# EAGLE design YAKS2-TITUO.R03.1al.v2smd (EAGLE 9.6.2)

## Sheet 1 of 2
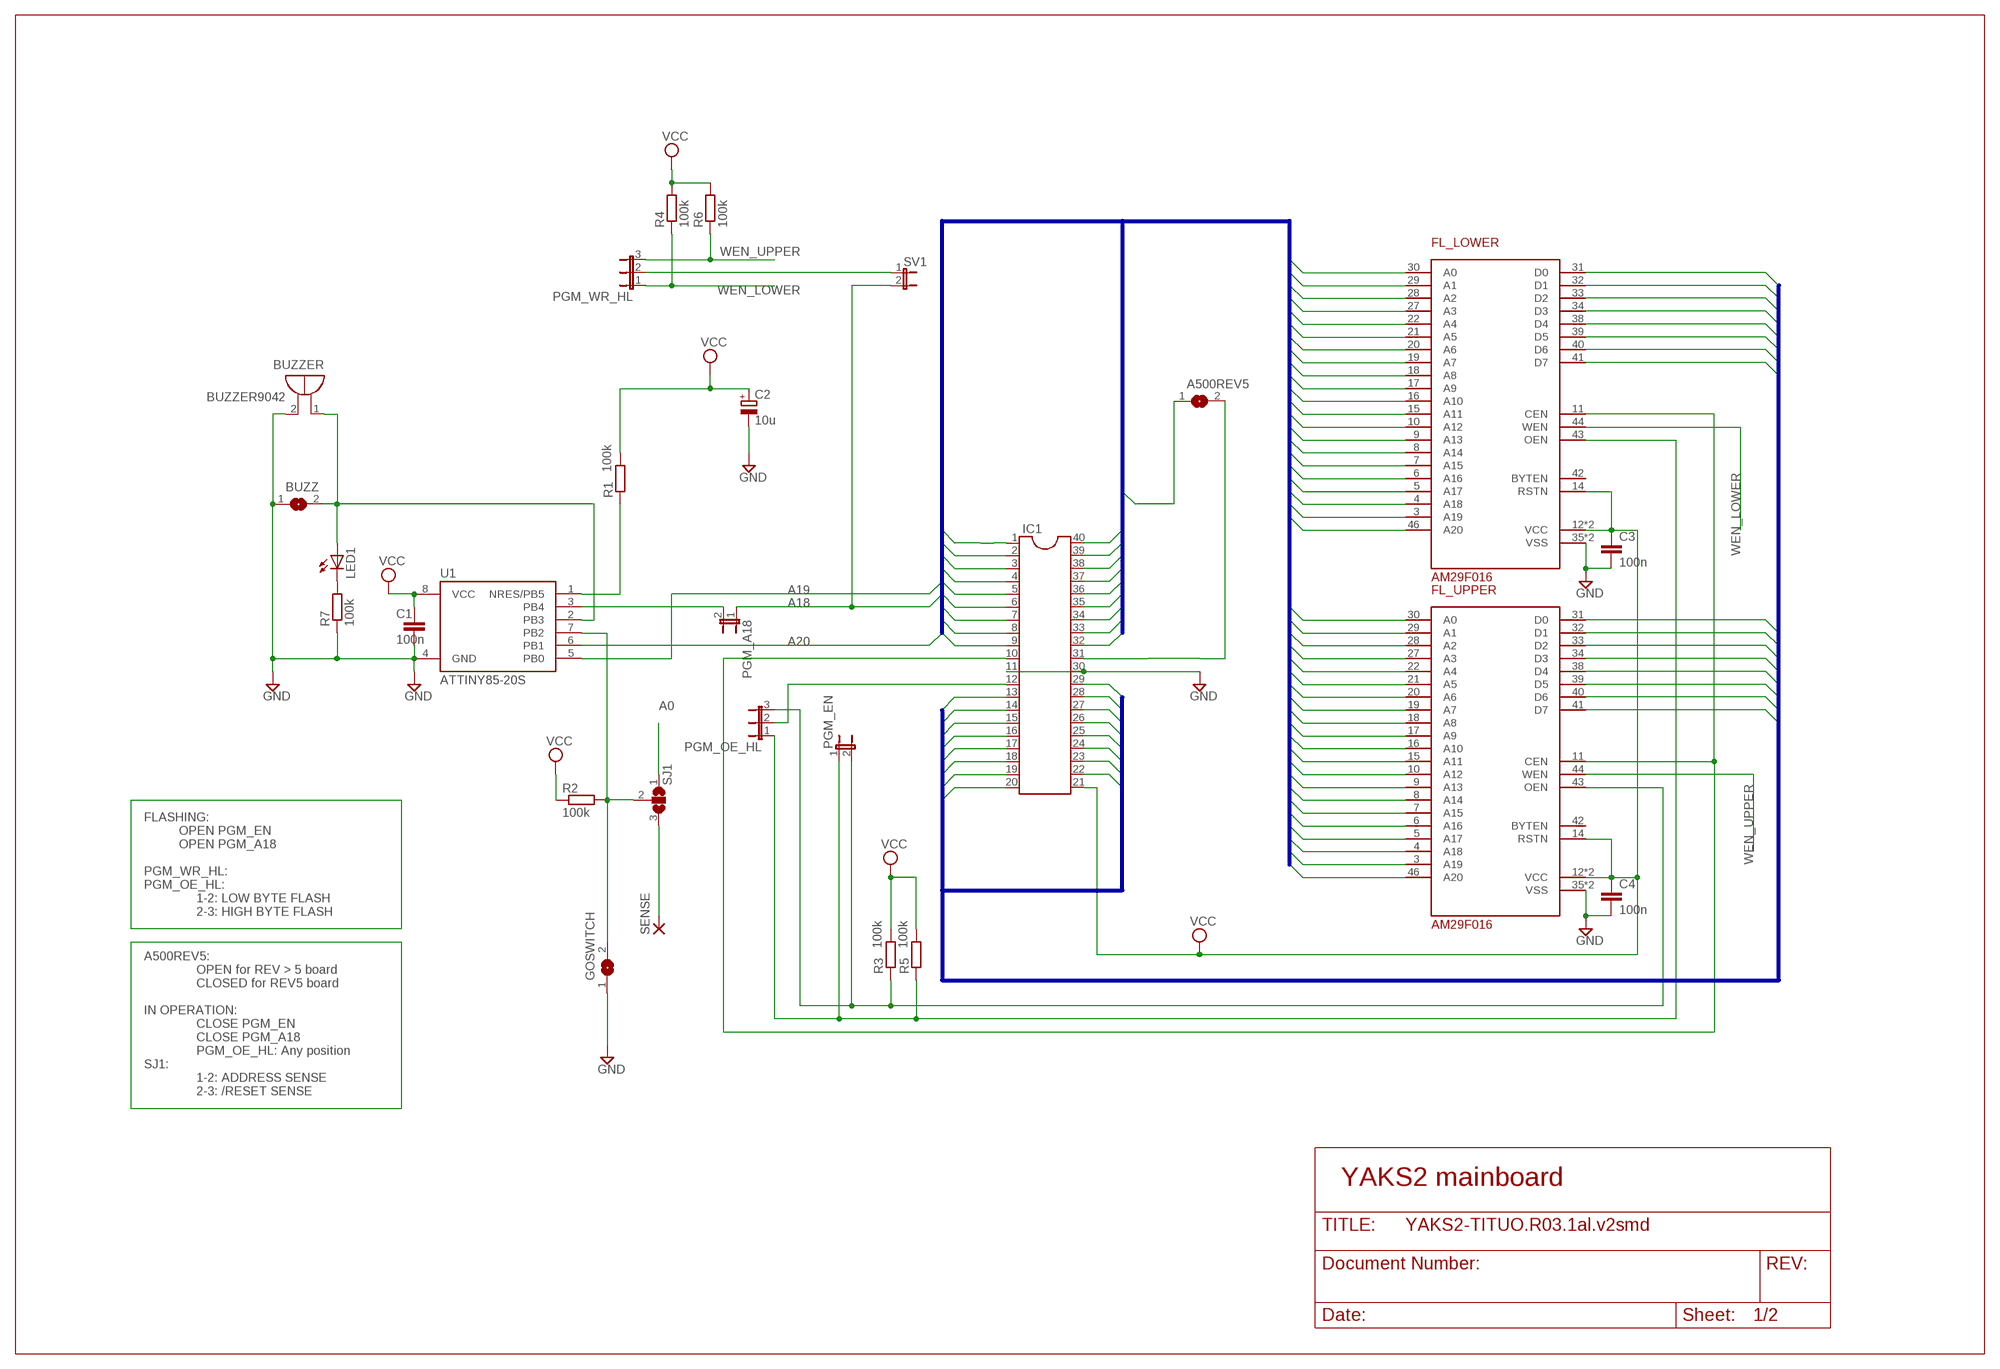
[diagram p0: schematic, sheet 1]

### Parts
A500REV5  SJ  [SJ]
BUZZ  SJ  [SJ]
BUZZER  BUZZER9042  [CAPPRD400W65D900H420B]
C1  100n  C-EUC0805  [C0805]
C2  10u  CPOL-EUB/3528-21R  [B/3528-21R]
C3  100n  C-EUC0805  [C0805]
C4  100n  C-EUC0805  [C0805]
FL_LOWER  AM29F016  [TSOP48]
FL_UPPER  AM29F016  [TSOP48]
GOSWITCH  SJ  [SJ]
IC1  DIL40  [DIL40]
LED1  LEDSML0805  [SML0805]
PGM_A18  JP1E  [JP1]
PGM_EN  JP1E  [JP1]
PGM_OE_HL  JP2E  [JP2]
PGM_WR_HL  JP2E  [JP2]
R1  100k  R-EU_M0805  [M0805]
R2  100k  R-EU_M0805  [M0805]
R3  100k  R-EU_M0805  [M0805]
R4  100k  R-EU_M0805  [M0805]
R5  100k  R-EU_M0805  [M0805]
R6  100k  R-EU_M0805  [M0805]
R7  100k  R-EU_M0805  [M0805]
SENSE  SMD2  [SMD1,27-2,54]
SJ1  SJ2W  [SJ_2]
SV1  JP1E  [JP1]
U1  ATTINY85-20S  [SOIC8_EIAJ_208MIL]

### Nets
A0: FL_LOWER.30(A0) FL_UPPER.30(A0) IC1.9 SJ1.1
A1: FL_LOWER.29(A1) FL_UPPER.29(A1) IC1.8
A2: FL_LOWER.28(A2) FL_UPPER.28(A2) IC1.7
A3: FL_LOWER.27(A3) FL_UPPER.27(A3) IC1.6
A4: FL_LOWER.22(A4) FL_UPPER.22(A4) IC1.5
A5: FL_LOWER.21(A5) FL_UPPER.21(A5) IC1.4
A6: FL_LOWER.20(A6) FL_UPPER.20(A6) IC1.3
A7: FL_LOWER.19(A7) FL_UPPER.19(A7) IC1.2
A8: FL_LOWER.18(A8) FL_UPPER.18(A8) IC1.40
A9: FL_LOWER.17(A9) FL_UPPER.17(A9) IC1.39
A10: FL_LOWER.16(A10) FL_UPPER.16(A10) IC1.38
A11: FL_LOWER.15(A11) FL_UPPER.15(A11) IC1.37
A12: FL_LOWER.10(A12) FL_UPPER.10(A12) IC1.36
A13: FL_LOWER.9(A13) FL_UPPER.9(A13) IC1.35
A14: FL_LOWER.8(A14) FL_UPPER.8(A14) IC1.34
A15: FL_LOWER.7(A15) FL_UPPER.7(A15) IC1.33
A16: FL_LOWER.6(A16) FL_UPPER.6(A16) IC1.32
A17: A500REV5.1 FL_LOWER.5(A17) FL_UPPER.5(A17) IC1.1
A18: FL_LOWER.4(A18) FL_UPPER.4(A18) PGM_A18.1 SV1.2
A19: FL_LOWER.3(A19) FL_UPPER.3(A19) U1.5(PB0)
A20: FL_LOWER.46(A20) FL_UPPER.46(A20) U1.6(PB1)
BUZZ: BUZZ.2 BUZZER.1(+) LED1.A U1.2(PB3)
D0: FL_LOWER.31(D0) IC1.13
D1: FL_LOWER.32(D1) IC1.15
D2: FL_LOWER.33(D2) IC1.17
D3: FL_LOWER.34(D3) IC1.19
D4: FL_LOWER.38(D4) IC1.22
D5: FL_LOWER.39(D5) IC1.24
D6: FL_LOWER.40(D6) IC1.26
D7: FL_LOWER.41(D7) IC1.28
D8: FL_UPPER.31(D0) IC1.14
D9: FL_UPPER.32(D1) IC1.16
D10: FL_UPPER.33(D2) IC1.18
D11: FL_UPPER.34(D3) IC1.20
D12: FL_UPPER.38(D4) IC1.23
D13: FL_UPPER.39(D5) IC1.25
D14: FL_UPPER.40(D6) IC1.27
D15: FL_UPPER.41(D7) IC1.29
GND: BUZZ.1 BUZZER.2(-) C1.2 C2.- C3.2 C4.2 FL_LOWER.35(VSS) FL_LOWER.36(VSS) FL_UPPER.35(VSS) FL_UPPER.36(VSS) GOSWITCH.1 IC1.11 IC1.30 R7.1 U1.4(GND)
N$1: LED1.C R7.2
N$2: PGM_WR_HL.2 SV1.1
N$3: A500REV5.2 IC1.31
N$6: GOSWITCH.2 R2.2 SJ1.2 U1.7(PB2)
N$7: IC1.12 PGM_OE_HL.2
N$8: SENSE.1(P) SJ1.3
N$9: R1.1 U1.1(NRES/PB5)
N$15: PGM_A18.2 U1.3(PB4)
OEN_LOWER: FL_LOWER.43(OEN) PGM_EN.1 PGM_OE_HL.1 R5.1
OEN_UPPER: FL_UPPER.43(OEN) PGM_EN.2 PGM_OE_HL.3 R3.1
ROM_ENABLE: FL_LOWER.11(CEN) FL_UPPER.11(CEN) IC1.10
VCC: C1.1 C2.+ C3.1 C4.1 FL_LOWER.12(VCC) FL_LOWER.14(RSTN) FL_LOWER.37(VCC) FL_UPPER.12(VCC) FL_UPPER.14(RSTN) FL_UPPER.37(VCC) IC1.21 R1.2 R2.1 R3.2 R4.2 R5.2 R6.2 U1.8(VCC)
WEN_LOWER: FL_LOWER.44(WEN) PGM_WR_HL.1 R4.1
WEN_UPPER: FL_UPPER.44(WEN) PGM_WR_HL.3 R6.1
Unconnected: FL_LOWER.42(BYTEN) FL_UPPER.42(BYTEN)

### Buses
A[0..20]
D[0..15]

### Notes on the sheet
- FLASHING:
            OPEN PGM_EN 
            OPEN PGM_A18
           
  PGM_WR_HL:
  PGM_OE_HL: 
                 1-2: LOW BYTE FLASH
                 2-3: HIGH BYTE FLASH
- A500REV5: 
                 OPEN for REV > 5 board
                 CLOSED for REV5 board
  
  IN OPERATION: 
                 CLOSE PGM_EN
                 CLOSE PGM_A18 
                 PGM_OE_HL: Any position
  SJ1:
                 1-2: ADDRESS SENSE
                 2-3: /RESET SENSE
- YAKS2 mainboard

## Sheet 2 of 2
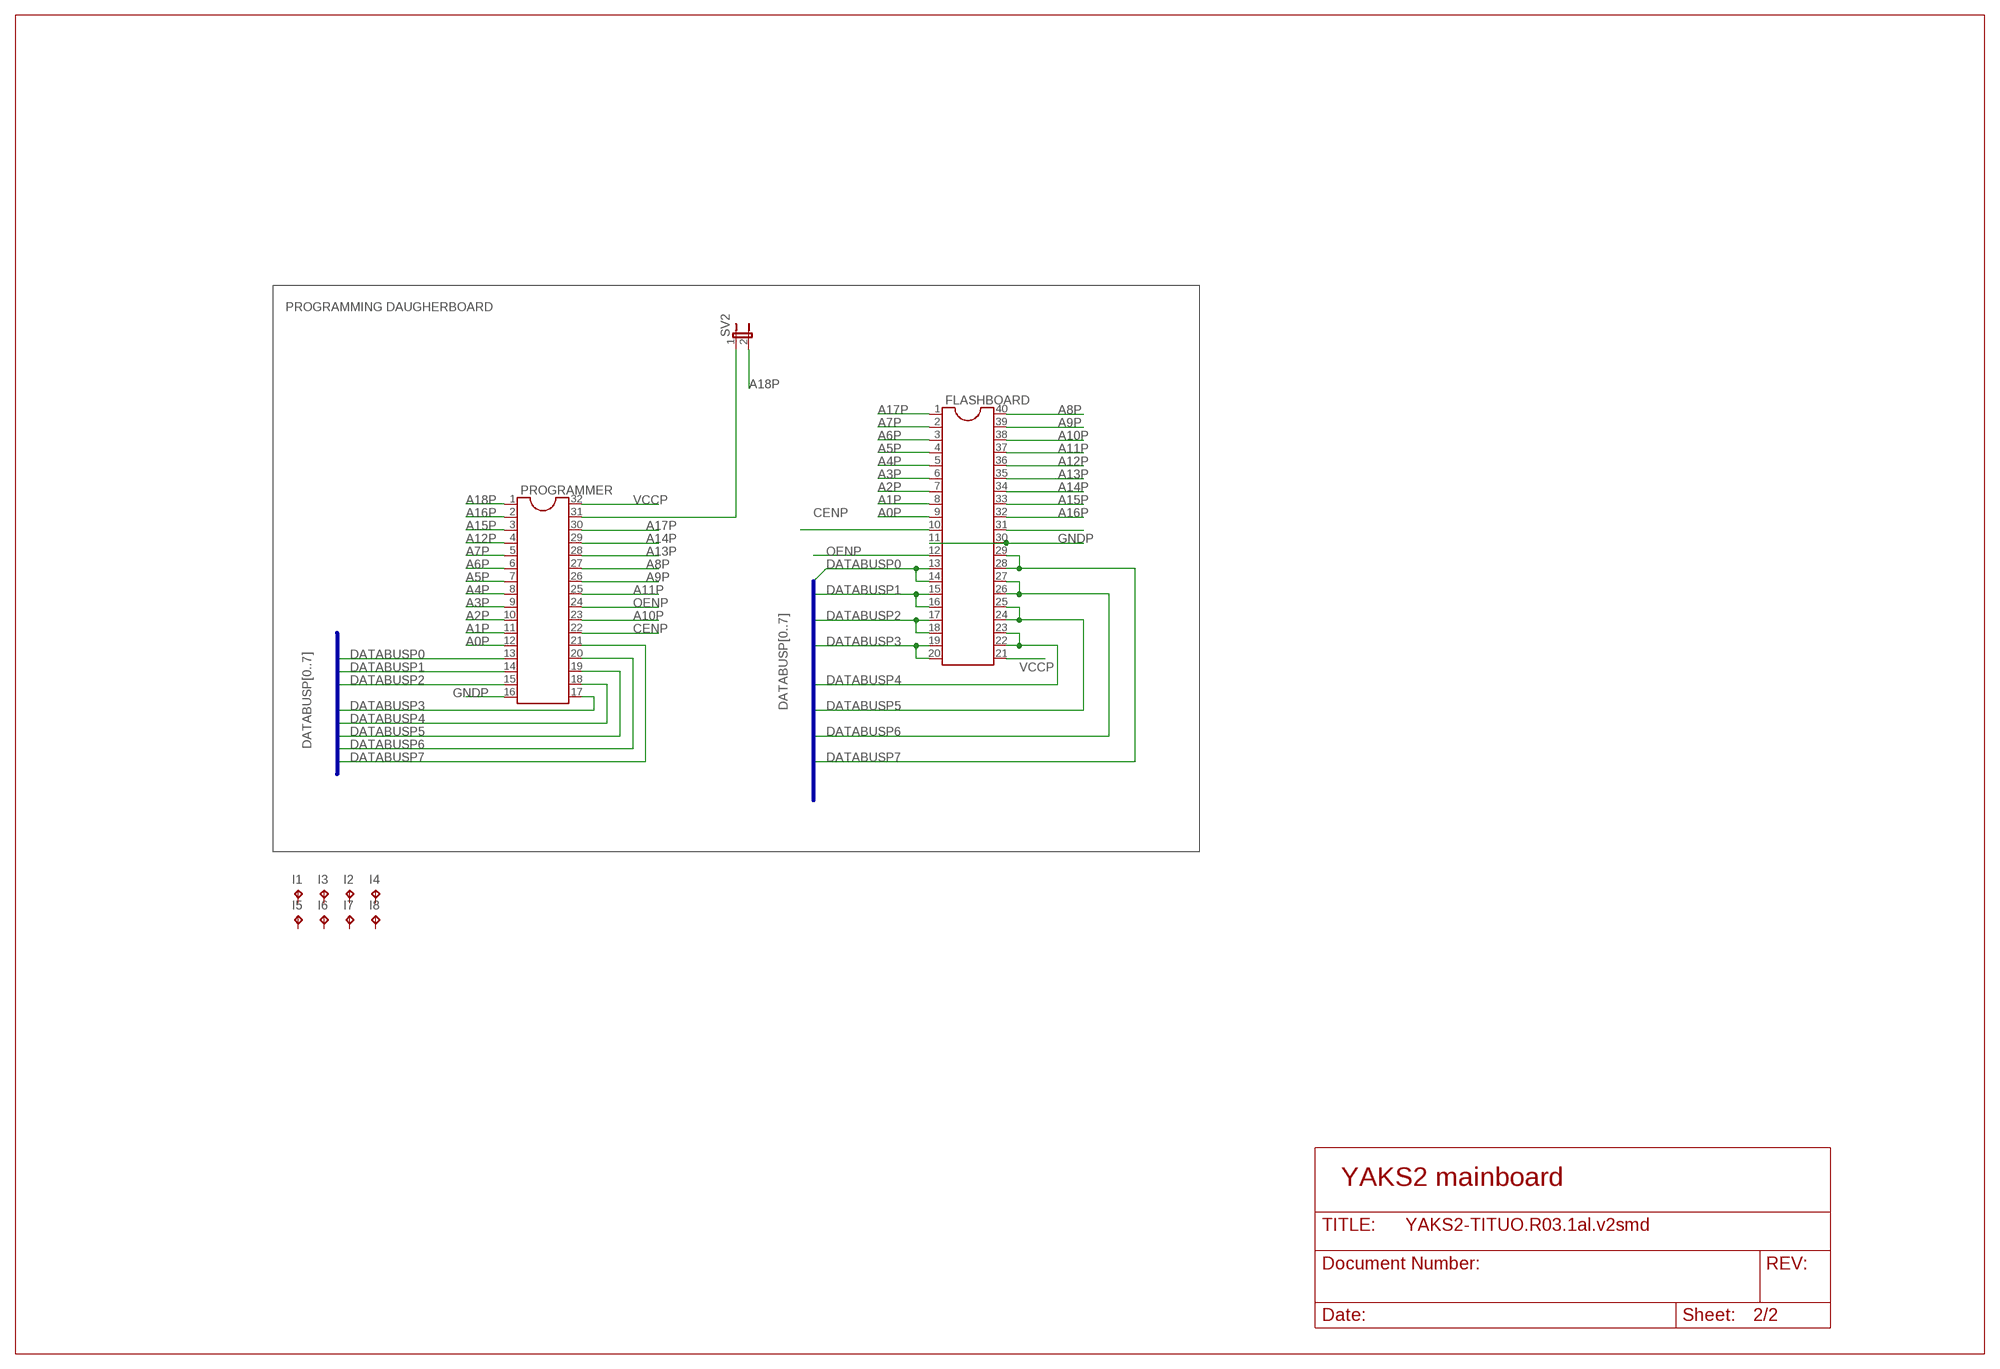
[diagram p1: schematic, sheet 2]

### Parts
FLASHBOARD  DIL40  [DIL40]
I1  TPTP20SQ  [TP20SQ]
I2  TPTP20SQ  [TP20SQ]
I3  TPTP20SQ  [TP20SQ]
I4  TPTP20SQ  [TP20SQ]
I5  TPTP20SQ  [TP20SQ]
I6  TPTP20SQ  [TP20SQ]
I7  TPTP20SQ  [TP20SQ]
I8  TPTP20SQ  [TP20SQ]
PROGRAMMER  DIL32  [DIL32]
SV2  JP1E  [JP1]

### Nets
A0P: FLASHBOARD.9 PROGRAMMER.12
A1P: FLASHBOARD.8 PROGRAMMER.11
A2P: FLASHBOARD.7 PROGRAMMER.10
A3P: FLASHBOARD.6 PROGRAMMER.9
A4P: FLASHBOARD.5 PROGRAMMER.8
A5P: FLASHBOARD.4 PROGRAMMER.7
A6P: FLASHBOARD.3 PROGRAMMER.6
A7P: FLASHBOARD.2 PROGRAMMER.5
A8P: FLASHBOARD.40 PROGRAMMER.27
A9P: FLASHBOARD.39 PROGRAMMER.26
A10P: FLASHBOARD.38 PROGRAMMER.23
A11P: FLASHBOARD.37 PROGRAMMER.25
A12P: FLASHBOARD.36 PROGRAMMER.4
A13P: FLASHBOARD.35 PROGRAMMER.28
A14P: FLASHBOARD.34 PROGRAMMER.29
A15P: FLASHBOARD.33 PROGRAMMER.3
A16P: FLASHBOARD.32 PROGRAMMER.2
A17P: FLASHBOARD.1 PROGRAMMER.30
A18P: PROGRAMMER.1 SV2.2
CENP: FLASHBOARD.10 PROGRAMMER.22
DATABUSP0: FLASHBOARD.13 FLASHBOARD.14 PROGRAMMER.13
DATABUSP1: FLASHBOARD.15 FLASHBOARD.16 PROGRAMMER.14
DATABUSP2: FLASHBOARD.17 FLASHBOARD.18 PROGRAMMER.15
DATABUSP3: FLASHBOARD.19 FLASHBOARD.20 PROGRAMMER.17
DATABUSP4: FLASHBOARD.22 FLASHBOARD.23 PROGRAMMER.18
DATABUSP5: FLASHBOARD.24 FLASHBOARD.25 PROGRAMMER.19
DATABUSP6: FLASHBOARD.26 FLASHBOARD.27 PROGRAMMER.20
DATABUSP7: FLASHBOARD.28 FLASHBOARD.29 PROGRAMMER.21
GNDP: FLASHBOARD.11 FLASHBOARD.30 PROGRAMMER.16
N$10: PROGRAMMER.31 SV2.1
N$14: FLASHBOARD.31
OENP: FLASHBOARD.12 PROGRAMMER.24
VCCP: FLASHBOARD.21 PROGRAMMER.32
Unconnected: I1.TP I2.TP I3.TP I4.TP I5.TP I6.TP I7.TP I8.TP

### Buses
DATABUSP[0..7]

### Notes on the sheet
- PROGRAMMING DAUGHERBOARD
- YAKS2 mainboard

## Library data of the parts
A500REV5 BUZZ GOSWITCH = jumper:SJ: SMD solder JUMPER
BUZZER = 9042.Buzzer:BUZZER9042
C1 C3 C4 = resistor:C-EU: CAPACITOR, European symbol
C2 = rcl:CPOL-EU: POLARIZED CAPACITOR, European symbol; SPICEPREFIX: C
FL_LOWER FL_UPPER = flashmemory:AM29F016
FLASHBOARD IC1 = ic-package:DIL40: Dual In Line
I1-I8 = testpad:TP: Test pad
LED1 = led:LED: LED OSRAM: - CHIPLED LG R971, LG N971, LY N971, LG Q971, LY Q971, LO R971, LY R971 LH N974, LH R974 LS Q976, LO Q976, LY Q976 LO Q996 - Hyper CHIPLED LW Q18S LB Q993, LB Q99A, LB R99A - SideLED LS A670, LO A670, LY A670, LG A670, LP A670 LB A673, LV A673, LT A673, LW A673 LH A674 LY A675 LS A676, LA A676, LO A676, LY A676, LW A676 LS A679, LY A679, LG A679 - Hyper Micro SIDELED® LS Y876, LA Y876, LO Y876, LY Y876 LT Y87S - SmartLED LW L88C, LW L88S LB L89C, LB L89S, LG L890 LS L89K, LO L89K, LY L89K LS L896, LA L896, LO L896, LY L896 - TOPLED LS T670, LO T670, LY T670, LG T670, LP T670 LSG T670, LSP T670, LSY T670, LOP T670, LYG T670 LG T671, LOG T671, LSG T671 LB T673, LV T673, LT T673, LW T673 LH T674 LS T676, LA T676, LO T676, LY T676, LB T676, LH T676, LSB T676, LW T676 LB T67C, LV T67C, LT T67C, LS T67K, LO T67K, LY T67K, LW E67C LS E67B, LA E67B, LO E67B, LY E67B, LB E67C, LV E67C, LT E67C LW T67C LS T679, LY T679, LG T679 LS T770, LO T770, LY T770, LG T770, LP T770 LB T773, LV T773, LT T773, LW T773 LH T774 LS E675, LA E675, LY E675, LS T675 LS T776, LA T776, LO T776, LY T776, LB T776 LHGB T686 LT T68C, LB T68C - Hyper Mini TOPLED® LB M676 - Mini TOPLED Santana® LG M470 LS M47K, LO M47K, LY M47K Source: http://www.osram.convergy.de LUXEON: - LUMILED® LXK2-PW12-R00, LXK2-PW12-S00, LXK2-PW14-U00, LXK2-PW14-V00 LXK2-PM12-R00, LXK2-PM12-S00, LXK2-PM14-U00 LXK2-PE12-Q00, LXK2-PE12-R00, LXK2-PE12-S00, LXK2-PE14-T00, LXK2-PE14-U00 LXK2-PB12-K00, LXK2-PB12-L00, LXK2-PB12-M00, LXK2-PB14-N00, LXK2-PB14-P00, LXK2-PB14-Q00 LXK2-PR12-L00, LXK2-PR12-M00, LXK2-PR14-Q00, LXK2-PR14-R00 LXK2-PD12-Q00, LXK2-PD12-R00, LXK2-PD12-S00 LXK2-PH12-R00, LXK2-PH12-S00 LXK2-PL12-P00, LXK2-PL12-Q00, LXK2-PL12-R00 Source: www.luxeon.com KINGBRIGHT: KA-3528ASYC Source: www.kingbright.com
PGM_A18 PGM_EN SV1 SV2 = jumper:JP1E: JUMPER
PGM_OE_HL PGM_WR_HL = jumper:JP2E: JUMPER
PROGRAMMER = ic-package:DIL32: Dual In Line
R1-R7 = resistor:R-EU_: RESISTOR, European symbol
SENSE = wirepad:SMD2: SMD PAD
SJ1 = jumper:SJ2W: SMD solder JUMPER
U1 = _hhn_attiny25_45_85:ATTINY85*: ATMEL ATtiny 85 Packages: P = PDIP 08 30mil S = SOIC 08 EIAJ 208mil Technologies Note: for complete ordering code (temp. range, finish, tape&reel etc.) see www.atmel.com • Supply Voltage: V = (1.8…5.5)V | [blank] = (2.7…5.5)V • Speed: 10 = 10 MHz | 20 = 20 MHz Author: Dipl.-Ing. FH Rainer Bayer HHN Hochschule Heilbronn (Heilbronn University), rainer.bayer@hs-heilbronn.de Ingenieurbüro ing-rb, mail@ing-rb.de

## Board
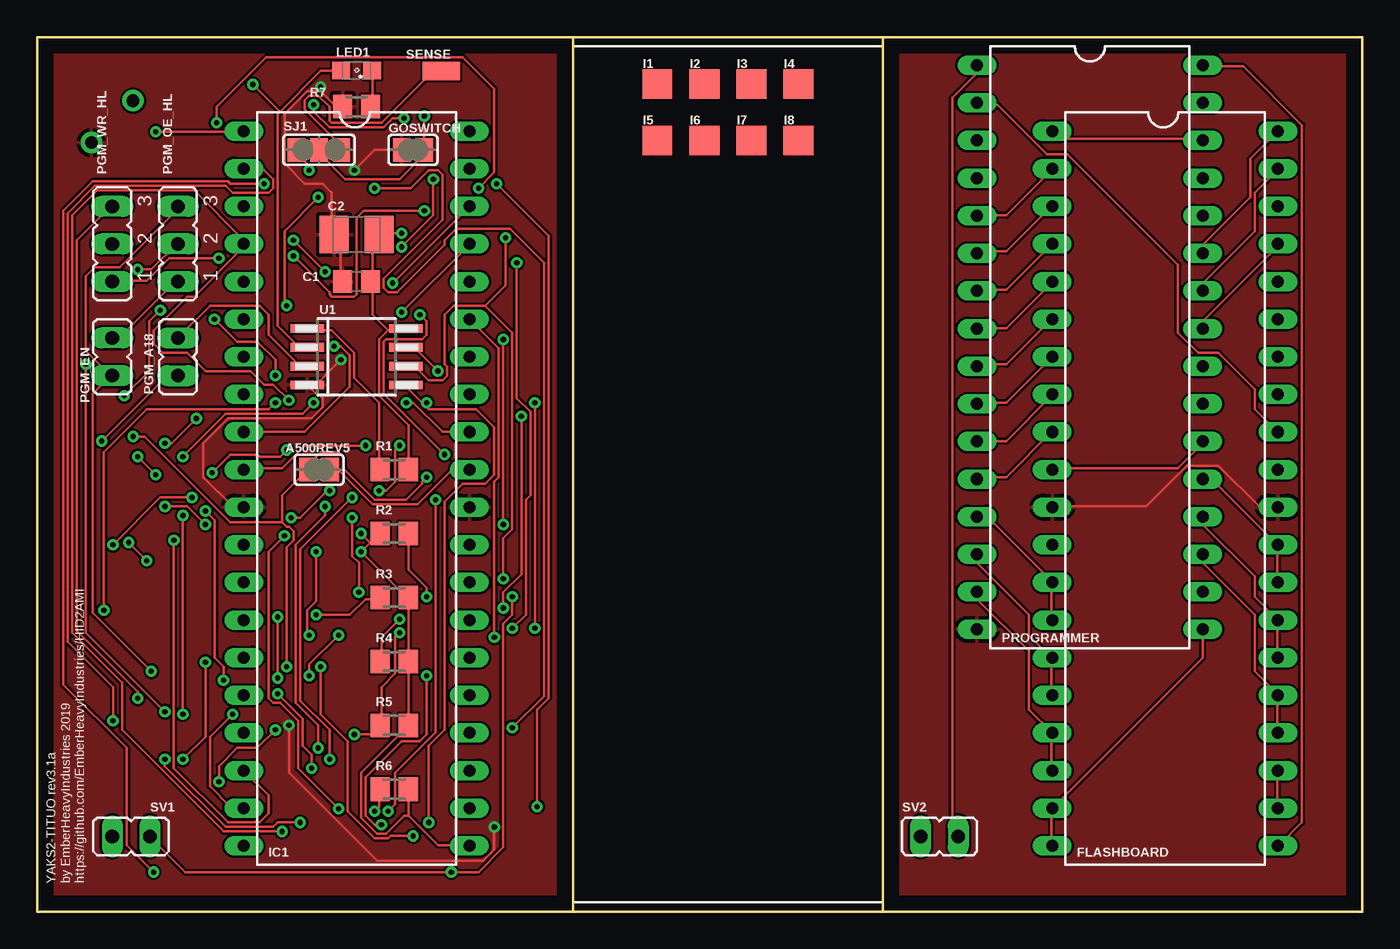
[diagram p2: board, top side]
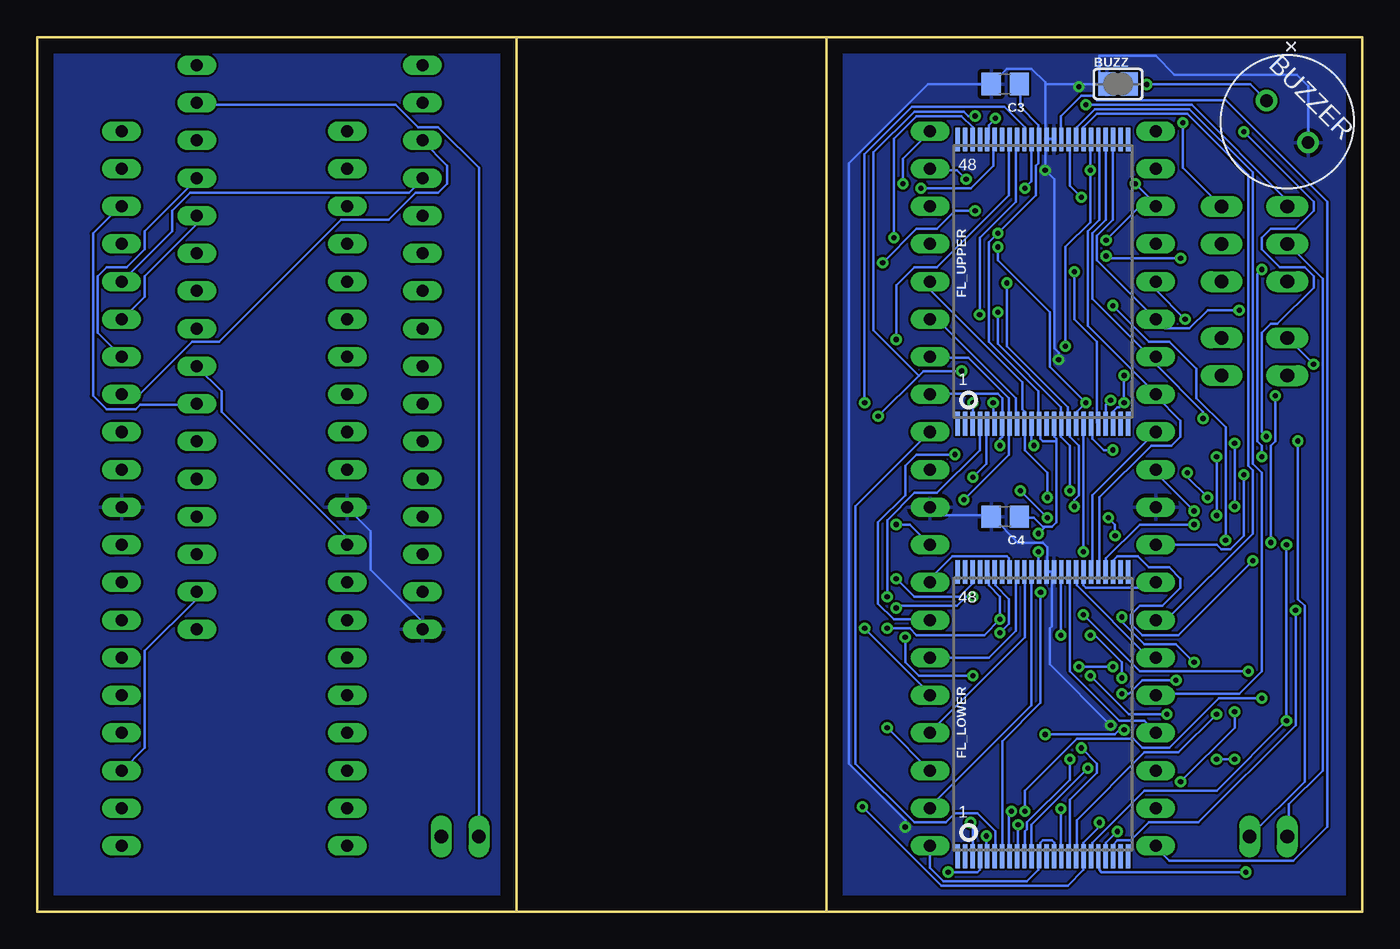
[diagram p3: board, bottom side, seen from below]

Size 89.53 x 59.05 mm. Coordinates in mm from the lower left corner, seen from the top.
Outline: 36.2,59.05 0,59.05 0,0 36.2,0
Outline: 36.2,59.05 57.15,59.05
Outline: 57.15,59.05 89.53,59.05 89.53,0 57.15,0
Outline: 36.2,0 57.15,0
Outline: 36.2,59.05 36.2,0
Outline: 57.15,59.05 57.15,0
Copper layers (1*16): Top 0.035mm / dielectric 1.5mm / Bottom 0.035mm
Design rules "default": minimum track width 6mil, minimum drill 0.35mm, track to track 6mil, track to pad 6mil, pad to pad 6mil, via to via 6mil, smd to smd 6mil, copper to edge 40mil, drill to drill 6mil, minimum pad ring 10mil, minimum via ring 8mil, stop-mask expansion 4mil, vias tented up to drill 0mil, thermal gap 10mil

### Footprints (pad centres in the part's own frame; a part is rotated, then mirrored left to right if it is on the bottom)
SJ = smd 1.168 x 1.6: 1 -0.762,0; 2 0.762,0
CAPPRD400W65D900H420B = drill 0.85 pad 1.45: 1 -2,0; 2 2,0
C0805 = smd 1.3 x 1.5: 1 -0.95,0; 2 0.95,0
B/3528-21R = smd 1.95 x 2.5: + 1.525,0; - -1.525,0
TSOP48 = smd 1.6 x 0.3: 1 -9.6,5.75; 2 -9.6,5.25; 3 -9.6,4.75; 4 -9.6,4.25; 5 -9.6,3.75; 6 -9.6,3.25; 7 -9.6,2.75; 8 -9.6,2.25; 9 -9.6,1.75; 10 -9.6,1.25; 11 -9.6,0.75; 12 -9.6,0.25; 13 -9.6,-0.25; 14 -9.6,-0.75; 15 -9.6,-1.25; 16 -9.6,-1.75; 17 -9.6,-2.25; 18 -9.6,-2.75; 19 -9.6,-3.25; 20 -9.6,-3.75; 21 -9.6,-4.25; 22 -9.6,-4.75; 23 -9.6,-5.25; 24 -9.6,-5.75; 25 9.6,-5.75; 26 9.6,-5.25; 27 9.6,-4.75; 28 9.6,-4.25; 29 9.6,-3.75; 30 9.6,-3.25; 31 9.6,-2.75; 32 9.6,-2.25; 33 9.6,-1.75; 34 9.6,-1.25; 35 9.6,-0.75; 36 9.6,-0.25; 37 9.6,0.25; 38 9.6,0.75; 39 9.6,1.25; 40 9.6,1.75; 41 9.6,2.25; 42 9.6,2.75; 43 9.6,3.25; 44 9.6,3.75; 45 9.6,4.25; 46 9.6,4.75; 47 9.6,5.25; 48 9.6,5.75
DIL40 = drill 0.813 long: 1 -24.13,-7.62; 2 -21.59,-7.62; 3 -19.05,-7.62; 4 -16.51,-7.62; 5 -13.97,-7.62; 6 -11.43,-7.62; 7 -8.89,-7.62; 8 -6.35,-7.62; 9 -3.81,-7.62; 10 -1.27,-7.62; 11 1.27,-7.62; 12 3.81,-7.62; 13 6.35,-7.62; 14 8.89,-7.62; 15 11.43,-7.62; 16 13.97,-7.62; 17 16.51,-7.62; 18 19.05,-7.62; 19 21.59,-7.62; 20 24.13,-7.62; 21 24.13,7.62; 22 21.59,7.62; 23 19.05,7.62; 24 16.51,7.62; 25 13.97,7.62; 26 11.43,7.62; 27 8.89,7.62; 28 6.35,7.62; 29 3.81,7.62; 30 1.27,7.62; 31 -1.27,7.62; 32 -3.81,7.62; 33 -6.35,7.62; 34 -8.89,7.62; 35 -11.43,7.62; 36 -13.97,7.62; 37 -16.51,7.62; 38 -19.05,7.62; 39 -21.59,7.62; 40 -24.13,7.62
TP20SQ = smd 2 x 2: TP 0,0
SML0805 = smd 1.2 x 1.2: A 1.05,0; C -1.05,0
JP1 = drill 0.914 long: 1 0,-1.27; 2 0,1.27
JP2 = drill 0.914 long: 1 -2.54,0; 2 0,0; 3 2.54,0
DIL32 = drill 0.813 long: 1 -19.05,-7.62; 2 -16.51,-7.62; 3 -13.97,-7.62; 4 -11.43,-7.62; 5 -8.89,-7.62; 6 -6.35,-7.62; 7 -3.81,-7.62; 8 -1.27,-7.62; 9 1.27,-7.62; 10 3.81,-7.62; 11 6.35,-7.62; 12 8.89,-7.62; 13 11.43,-7.62; 14 13.97,-7.62; 15 16.51,-7.62; 16 19.05,-7.62; 17 19.05,7.62; 18 16.51,7.62; 19 13.97,7.62; 20 11.43,7.62; 21 8.89,7.62; 22 6.35,7.62; 23 3.81,7.62; 24 1.27,7.62; 25 -1.27,7.62; 26 -3.81,7.62; 27 -6.35,7.62; 28 -8.89,7.62; 29 -11.43,7.62; 30 -13.97,7.62; 31 -16.51,7.62; 32 -19.05,7.62
M0805 = smd 1.3 x 1.6: 1 -0.95,0; 2 0.95,0
SMD1,27-2,54 = smd 1.27 x 2.54: 1 0,0
SJ_2 = smd 1.168 x 1.6: 1 -1.524,0; 2 0,0; 3 1.524,0
SOIC8_EIAJ_208MIL = smd 0.6 x 2.286: 1 -1.905,-3.33; 2 -0.635,-3.33; 3 0.635,-3.33; 4 1.905,-3.33; 5 1.905,3.33; 6 0.635,3.33; 7 -0.635,3.33; 8 -1.905,3.33

### Placement (x,y rotation side)
A500REV5  19.05,29.84 0 top
BUZZ  16.51,55.88 0 bottom
BUZZER  5.08,53.34 315 bottom
C1  21.59,42.55 180 top
C2  21.59,45.72 0 top
C3  24.13,55.88 180 bottom
C4  24.13,26.67 180 bottom
FL_LOWER  21.59,13.34 90 bottom
FL_UPPER  21.59,42.55 90 bottom
FLASHBOARD  76.2,28.58 270 top
GOSWITCH  25.4,51.44 0 top
I1  41.91,55.88 0 top
I2  45.09,55.88 0 top
I3  48.26,55.88 0 top
I4  51.44,55.88 0 top
I5  41.91,52.07 0 top
I6  45.09,52.07 0 top
I7  48.26,52.07 0 top
I8  51.44,52.07 0 top
IC1  21.59,28.58 270 top
LED1  21.59,56.8 180 top
PGM_A18  9.52,37.46 0 top
PGM_EN  5.08,37.46 180 top
PGM_OE_HL  9.52,45.08 90 top
PGM_WR_HL  5.08,45.08 90 top
PROGRAMMER  71.12,38.1 270 top
R1  24.13,29.84 0 top
R2  24.13,25.53 0 top
R3  24.13,21.21 0 top
R4  24.13,16.89 0 top
R5  24.13,12.57 0 top
R6  24.13,8.26 0 top
R7  21.59,54.36 0 top
SENSE  27.3,56.76 270 top
SJ1  19.05,51.44 0 top
SV1  6.35,5.08 270 top
SV2  60.96,5.08 270 top
U1  21.59,37.46 270 top

### Tracks (layer width: path | path; a pad name or v marks a point on that pad's centre or on a via)
A0  (via drill 0.35)
  Top 0.152: v18.39,50.06 18.39,50.37 17.63,51.13 17.63,51.44 SJ1.1 | v20.07,38.18 20.52,38.18 21.13,37.57 21.13,35.43 18.09,32.38 IC1.9
  Bottom 0.152: FL_UPPER.30 18.39,52.05 v18.39,50.06 18.39,46.56 20.07,44.88 v20.07,38.18 | IC1.9 18.24,28.12 18.24,22.94 FL_LOWER.30
A0P
  Top 0.152: PROGRAMMER.12 63.5,29.34 65.48,29.34 68.53,32.38 FLASHBOARD.9
A1
  Bottom 0.152: FL_LOWER.29 17.78,22.94 17.78,27.96 14.27,31.47 12.9,31.47 12.29,32.08 12.29,33.15 13.97,34.82 IC1.8 13.97,34.98 18.54,39.55 18.54,45.95 17.78,46.71 17.78,52.05 FL_UPPER.29
A1P
  Top 0.152: PROGRAMMER.11 63.5,31.77 65.48,31.77 68.53,34.82 FLASHBOARD.8
A2  (via drill 0.35)
  Top 0.152: v11.38,26.14 10.16,27.36 v8.64,27.36 | v8.64,31.62 9.09,31.62 v10.77,33.3
  Bottom 0.152: v11.38,26.14 15.04,26.14 17.32,23.85 17.32,22.94 FL_LOWER.28 | v8.64,31.62 v8.64,27.36 | v10.77,33.3 10.77,33.76 13.97,36.96 IC1.7 13.97,37.57 14.43,37.57 18.24,41.38 18.24,45.8 17.32,46.71 17.32,52.05 FL_UPPER.28
A2P
  Top 0.152: FLASHBOARD.7 65.48,34.37 63.5,34.37 PROGRAMMER.10
A3  (via drill 0.35)
  Top 0.152: v6.2,24.92 v7.42,23.7 | v5.89,34.82 7.57,36.5 7.57,39.85 v8.33,40.61
  Bottom 0.152: v7.42,23.7 12.45,18.67 14.88,18.67 15.65,19.43 15.65,20.04 15.04,20.65 13.51,20.65 12.29,21.87 12.29,22.48 13.06,23.24 14.43,23.24 15.19,24 16.56,24 16.87,23.7 16.87,22.94 FL_LOWER.27 | v6.2,24.92 6.2,31.47 5.89,31.77 v5.89,34.82 | v8.33,40.61 10.46,40.61 11.68,39.39 13.36,39.39 IC1.6 17.93,43.97 17.93,45.64 16.87,46.71 16.87,52.05 FL_UPPER.27
A3P
  Top 0.152: PROGRAMMER.9 63.5,36.96 65.48,36.96 68.53,40 FLASHBOARD.6
A4  (via drill 0.35)
  Top 0.152: v4.52,20.34 4.52,31.01 7.42,33.91 15.65,33.91 v16.1,34.37 | v11.99,40 13.51,38.48 14.88,38.48 16.1,37.26 v16.1,36.2
  Bottom 0.152: v4.52,20.34 4.52,12.57 11.07,6.02 14.43,6.02 15.65,4.8 16.56,4.8 16.87,4.5 16.87,3.89 FL_LOWER.22 | FL_UPPER.22 16.87,32.99 16.87,33.76 16.56,34.06 16.41,34.06 v16.1,34.37 v16.1,36.2 | IC1.5 13.97,41.99 v11.99,40
A4P
  Top 0.152: PROGRAMMER.8 63.5,39.39 65.48,39.39 68.53,42.44 FLASHBOARD.5
A5  (via drill 0.35)
  Top 0.152: v16.56,5.41 12.6,5.41 5.74,12.27 5.74,15.47 2.39,18.82 2.39,47.02 4.06,48.69 10.62,48.69 13.97,45.34 IC1.4 13.97,44.88 10.62,41.53 10.16,41.53 7.87,39.24 7.87,38.33 8.48,37.72 10.16,37.72 11.38,36.5 14.43,36.5 15.34,35.59 15.95,35.59 v17.02,34.52
  Bottom 0.152: v16.56,5.41 17.32,4.65 17.32,3.89 FL_LOWER.21 | v17.02,34.52 17.32,34.21 17.32,32.99 FL_UPPER.21
A5P
  Top 0.152: FLASHBOARD.4 65.48,41.99 63.5,41.99 PROGRAMMER.7
A6  (via drill 0.35)
  Top 0.152: v7.87,2.67 6.04,4.5 6.04,11.05 1.78,15.32 1.78,47.32 3.76,49.3 12.9,49.3 13.06,49.15 v15.34,49.15 | v17.32,45.34 v19.46,43.2
  Bottom 0.152: v7.87,2.67 17.63,2.67 17.78,2.82 17.78,3.73 FL_LOWER.20 | 14.43,48.23 13.97,47.78 IC1.3 14.43,48.23 | 14.43,48.23 v15.34,49.15 | v19.46,43.2 19.46,40 17.93,38.48 17.93,32.99 FL_UPPER.20 | 14.43,48.23 v17.32,45.34
A6P
  Top 0.152: PROGRAMMER.6 63.5,44.58 65.48,44.58 68.53,47.62 FLASHBOARD.3
A7  (via drill 0.35)
  Top 0.152: v5.13,12.88 5.13,15.16 2.08,18.21 2.08,47.17 3.91,49 12.75,49 13.21,48.54 15.65,48.54 15.95,48.84 15.95,49.45 15.34,50.06 13.97,50.06 IC1.2 | v16.87,31.17 16.41,30.71 15.04,30.71 14.88,30.86 13.06,30.86 v11.84,29.64 | v10.46,27.96 8.33,27.96 v5.13,24.77
  Bottom 0.152: FL_LOWER.19 18.24,3.89 18.24,4.65 14.73,8.15 9.86,8.15 v5.13,12.88 v5.13,24.77 | v16.87,31.17 17.47,31.17 18.24,31.93 18.24,32.84 FL_UPPER.19 | v11.84,29.64 11.84,29.34 v10.46,27.96
A7P
  Top 0.152: PROGRAMMER.5 63.5,47.02 65.48,47.02 68.53,50.06 FLASHBOARD.2
A8  (via drill 0.35)
  Top 0.152: v33.78,7.09 33.78,13.64 34.54,14.4 34.54,45.64 v31.04,49.15 | v18.85,24.31 18.85,20.95 18.24,20.34 18.24,18.82 v18.39,18.67 | v16.26,19.89 v16.26,15.77 | v11.38,16.84 11.38,11.81 v9.86,10.29 | v8.64,10.29 8.64,9.83 12.75,5.71 15.95,5.71 16.26,6.02 v17.78,6.02
  Bottom 0.152: v33.78,7.09 28.45,1.75 19.91,1.75 18.85,2.82 FL_LOWER.18 18.85,3.89 18.85,4.65 17.78,5.71 v17.78,6.02 | v31.04,49.15 31.04,50.83 29.21,52.65 IC1.40 | v18.85,24.31 18.85,32.84 FL_UPPER.18 | v18.39,18.67 18.09,18.67 16.26,16.84 v16.26,15.77 | v16.26,19.89 16.26,19.58 14.73,18.06 12.6,18.06 v11.38,16.84 | v8.64,10.29 v9.86,10.29
A8P
  Top 0.152: PROGRAMMER.27 78.74,45.03 81.94,48.23 81.94,50.83 FLASHBOARD.40
A9  (via drill 0.35)
  Top 0.152: v9.86,26.75 v9.86,13.34 | v9.86,30.71 12.75,33.6 17.93,33.6 v18.69,34.37 | v26.77,49.45 26.77,47.02 v24.64,44.88
  Bottom 0.152: v9.86,13.34 12.45,10.74 14.73,10.74 19.3,6.17 19.3,3.89 FL_LOWER.17 | v9.86,30.71 v9.86,26.75 | FL_UPPER.17 19.3,32.99 19.3,33.76 v18.69,34.37 21.13,36.8 21.13,40.46 24.64,43.97 v24.64,44.88 | v26.77,49.45 27.38,50.06 29.21,50.06 IC1.39
A9P
  Top 0.152: PROGRAMMER.26 78.74,42.44 82.25,45.95 82.25,48.54 83.77,50.06 FLASHBOARD.39
A10  (via drill 0.35)
  Top 0.152: v19,11.05 19,12.57 17.47,14.1 17.47,24.77 19.46,26.75 v19.46,27.36 | v24.03,42.44 IC1.38
  Bottom 0.152: v19,11.05 17.93,9.98 17.93,9.37 19.76,7.54 19.76,3.89 FL_LOWER.16 | v19.46,27.36 19.46,27.81 19.15,28.12 19.15,31.47 19.76,32.08 19.76,32.84 FL_UPPER.16 19.91,32.99 19.91,34.06 24.03,38.18 v24.03,42.44
A10P
  Bottom 0.152: PROGRAMMER.23 78.74,34.21 82.55,34.21 82.86,33.91 84.84,33.91 85.75,34.82 85.75,45.8 83.92,47.62 FLASHBOARD.38
A11  (via drill 0.35)
  Top 0.152: v20.37,6.93 17.63,9.68 17.63,12.88 16.41,14.1 15.95,14.1 15.65,14.4 15.65,24.31 v16.71,25.38 | v17.17,26.59 17.78,26.59 19.61,28.42 v19.76,28.42 | v24.64,40.46 29.21,45.03 IC1.37
  Bottom 0.152: v20.37,6.93 20.37,3.89 FL_LOWER.15 | v16.71,25.38 16.71,26.14 v17.17,26.59 | v19.76,28.42 19.76,31.47 20.37,32.08 20.37,32.84 FL_UPPER.15 20.37,32.99 20.37,34.06 24.64,38.33 v24.64,40.46
A11P
  Top 0.152: PROGRAMMER.25 78.74,39.85 83.92,45.03 FLASHBOARD.37
A12  (via drill 0.35)
  Top 0.152: v19.76,10.29 19.76,12.27 17.78,14.25 17.78,24.46 v21.29,27.96
  Bottom 0.152: v19.76,10.29 19.76,8.91 22.66,6.02 22.66,5.56 22.81,5.41 22.81,3.89 FL_LOWER.10 | v21.29,27.96 21.29,29.64 22.81,31.17 22.81,32.84 FL_UPPER.10 22.81,32.99 22.81,33.76 22.96,33.91 22.96,35.74 29.21,41.99 IC1.36
A12P
  Bottom 0.152: FLASHBOARD.36 80.42,45.95 80.42,47.32 79.2,48.54 64.41,48.54 63.5,49.45 PROGRAMMER.4
A13  (via drill 0.35)
  Top 0.152: v23.27,5.87 22.81,5.87 22.2,6.48 22.2,9.07 24.64,11.51 25.86,11.51 26.31,11.96 v26.31,15.93 | v30.89,18.52 30.89,29.03 31.19,29.34 31.19,38.02 IC1.35
  Bottom 0.152: v23.27,5.87 23.27,3.89 FL_LOWER.9 | v26.31,15.93 29.97,15.93 30.89,16.84 v30.89,18.52 | IC1.35 28.75,40 23.42,34.67 23.42,32.99 FL_UPPER.9
A13P
  Bottom 0.152: PROGRAMMER.28 78.74,46.41 82.25,42.9 82.25,41.53 83.77,40 FLASHBOARD.35
A14  (via drill 0.35)
  Top 0.152: v23.72,6.78 24.18,7.24 24.18,9.37 26.92,12.12 v26.92,27.81
  Bottom 0.152: v23.72,6.78 23.88,6.63 23.88,3.89 FL_LOWER.8 | v26.92,27.81 23.88,30.86 23.88,32.84 FL_UPPER.8 23.88,32.99 23.88,34.67 26.62,37.41 29.21,37.41 IC1.34
A14P
  Bottom 0.152: FLASHBOARD.34 85.45,39.09 85.45,42.9 84.84,43.51 83.46,43.51 82.25,44.73 82.25,45.95 78.74,49.45 PROGRAMMER.29
A15  (via drill 0.35)
  Top 0.152: v21.74,21.56 21.74,23.55 21.29,24 v21.29,26.59 | v23.11,28.42 23.57,28.42 24.18,29.03 24.18,31.17 v24.49,31.47
  Bottom 0.152: v21.74,21.56 21.74,14.1 24.33,11.51 24.33,3.89 FL_LOWER.7 | v23.11,28.42 v21.29,26.59 | v24.49,31.47 24.49,31.93 24.33,32.08 24.33,32.84 FL_UPPER.7 24.33,32.99 24.33,34.67 24.64,34.98 29.21,34.98 IC1.33
A15P
  Bottom 0.152: FLASHBOARD.33 83.77,34.98 82.55,34.98 79.05,38.48 77.22,38.48 68.99,46.71 65.79,46.71 63.96,48.54 62.43,48.54 61.82,49.15 61.82,50.37 63.5,52.05 PROGRAMMER.3
A16  (via drill 0.35)
  Top 0.152: v24.94,34.37 25.4,34.37 27.38,32.38 IC1.32
  Bottom 0.152: IC1.32 34.24,27.36 34.24,9.98 30.28,6.02 28.14,6.02 27.53,6.63 26.01,6.63 24.79,5.41 24.79,3.89 FL_LOWER.6 | v24.94,34.37 24.94,32.99 FL_UPPER.6
A16P
  Top 0.152: PROGRAMMER.2 63.5,54.48 64.87,54.48 68.22,51.13 69.6,51.13 77.06,43.66 77.06,39.09 78.44,37.72 79.81,37.72 82.25,35.28 82.25,33.91 83.77,32.38 FLASHBOARD.32
A17  (via drill 0.35)
  Top 0.152: v25.4,5.11 23.88,5.11 23.72,4.95 22.81,4.95 20.98,6.78 20.98,11.51 19.15,13.34 v19.15,16.53 | v16.87,16.53 16.87,24.61 17.32,25.07 17.32,25.68 17.02,25.98 16.87,25.98 16.56,26.29 | 16.56,26.29 16.56,28.12 A500REV5.1 18.39,29.95 18.39,30.25 19.15,31.01 20.37,31.01 20.68,30.71 20.68,29.95 22.81,27.81 24.94,27.81 26.01,28.88 26.01,29.03 v26.31,29.34 | v8.03,52.65 13.97,52.65 IC1.1 | v6.5,32.08 7.26,32.08 13.06,26.29 16.56,26.29
  Bottom 0.152: v25.4,5.11 25.4,3.89 FL_LOWER.5 | v16.87,16.53 v19.15,16.53 | v26.31,29.34 25.4,30.25 25.4,32.84 FL_UPPER.5 | v8.03,52.65 3.3,47.93 3.3,47.32 4.52,46.1 6.2,46.1 6.81,45.49 6.81,44.73 5.59,43.51 3.91,43.51 3.3,42.9 3.3,42.14 5.74,39.7 6.2,39.7 6.81,39.09 6.81,32.38 v6.5,32.08
A17P
  Top 0.152: PROGRAMMER.30 78.74,52.2 69.14,52.2 68.68,52.65 FLASHBOARD.1
A18  (via drill 0.35)
  Top 0.152: SV1.2 7.72,4.95 10.01,2.67 v27.99,2.67 29.82,2.67 31.5,4.34 31.5,19.43 32.11,20.04 v32.11,21.26 | PGM_A18.1 8.79,36.2 v4.37,31.77
  Bottom 0.152: v27.99,2.67 26.01,2.67 25.86,2.82 25.86,3.73 FL_LOWER.4 | v32.11,21.26 32.11,26.44 30.28,28.27 28.75,28.27 25.86,31.17 25.86,32.84 FL_UPPER.4 | v4.37,31.77 4.37,21.11 3.91,20.65 3.91,8.76 7.57,5.11 SV1.2
A18P
  Top 0.152: PROGRAMMER.1 63.5,56.62 61.82,54.94 61.82,5.41 62.13,5.11 SV2.2
A19  (via drill 0.35)
  Top 0.152: v26.47,6.02 26.47,11.2 27.53,12.27 27.53,27.66 28.75,28.88 30.28,28.88 30.89,29.49 30.89,32.69 29.67,33.91 26.47,33.91 26.16,34.21 | 26.16,34.21 24.94,35.43 U1.5 | 26.16,34.21 v26.31,34.37
  Bottom 0.152: v26.47,6.02 26.31,5.87 26.31,3.89 FL_LOWER.3 | v26.31,34.37 26.31,32.99 FL_UPPER.3
A20  (via drill 0.35)
  Top 0.152: v31.5,22.48 31.5,25.22 32.11,25.83 32.11,39.09 30.28,40.92 | 30.28,40.92 28.14,40.92 27.53,40.31 27.53,36.96 27.69,36.8 27.69,36.2 27.38,35.89 26.47,35.89 25.55,36.8 24.94,36.8 U1.6 | v31.65,45.49 31.65,42.29 30.28,40.92
  Bottom 0.152: v31.5,22.48 30.28,21.26 27.23,21.26 26.31,22.17 26.31,22.78 FL_LOWER.46 | v31.65,45.49 31.65,52.2 30.12,53.72 27.08,53.72 26.31,52.96 26.31,52.2 FL_UPPER.46
BUZZ  (via drill 0.35)
  Top 0.152: 16.41,54.03 16.26,53.87 16.26,39.55 17.63,38.18 18.24,38.18 U1.2 | 16.41,54.03 19.15,56.77 20.52,56.77 LED1.A | 16.41,54.03 v14.58,55.86
  Bottom 0.152: BUZZ.2 15.65,55.86 14.61,55.86 v14.58,55.86 7.59,55.86 BUZZER.1
CENP
  Top 0.152: FLASHBOARD.10 68.68,29.95 77.06,29.95 78.74,31.62 PROGRAMMER.22
D0
  Bottom 0.152: FL_LOWER.31 18.85,22.78 18.85,22.02 18.69,21.87 14.27,21.87 13.97,22.17 IC1.13
D1
  Bottom 0.152: IC1.15 14.43,17.14 19.3,22.02 19.3,22.78 FL_LOWER.32
D2
  Bottom 0.152: FL_LOWER.33 19.76,22.78 19.76,16.23 16.41,12.88 14.73,12.88 13.97,12.12 IC1.17
D3  (via drill 0.35)
  Top 0.152: v20.37,18.67 18.39,16.69 v18.39,15.93 | v13.21,13.34 11.68,11.81 11.68,8.46 13.06,7.09 13.97,7.09 IC1.19
  Bottom 0.152: v20.37,18.67 20.37,22.78 FL_LOWER.34 | v18.39,15.93 15.8,13.34 v13.21,13.34
D4
  Bottom 0.152: FL_LOWER.38 22.35,22.78 22.35,13.95 29.21,7.09 IC1.22
D5
  Bottom 0.152: FL_LOWER.39 22.81,22.78 22.81,18.52 29.21,12.12 IC1.24
D6
  Bottom 0.152: IC1.26 25.25,17.14 23.42,18.97 23.42,22.78 FL_LOWER.40
D7
  Bottom 0.152: IC1.28 29.21,22.48 27.69,24 24.03,24 23.88,23.85 23.88,22.94 FL_LOWER.41
D8
  Bottom 0.152: FL_UPPER.31 18.85,52.2 18.85,52.96 17.93,53.87 11.84,53.87 7.72,49.76 7.72,30.1 7.42,29.79 7.42,25.53 13.21,19.74 13.97,19.74 IC1.14
D9
  Bottom 0.152: FL_UPPER.32 19.3,52.2 19.3,52.96 18.09,54.18 11.68,54.18 7.42,49.91 7.42,30.25 6.81,29.64 6.81,16.23 8.33,14.71 13.97,14.71 IC1.16
D10  (via drill 0.35)
  Top 0.152: v19,48.23 16.71,45.95 16.71,41.07 v16.87,40.92 | v9.25,25.07 9.25,9.68 12.9,6.02 15.04,6.02 15.65,6.63 15.65,7.85 IC1.18
  Bottom 0.152: v19,48.23 19.76,49 19.76,52.05 FL_UPPER.33 | v16.87,40.92 14.43,38.48 13.06,38.48 11.23,36.65 11.23,34.67 9.25,32.69 v9.25,25.07
D11
  Bottom 0.152: FL_UPPER.34 20.37,52.2 20.37,53.72 19,55.09 18.24,55.09 17.93,54.79 9.25,54.79 2.39,47.93 2.39,5.71 4.67,3.43 13.06,3.43 13.97,4.34 IC1.20
D12  (via drill 0.35)
  Top 0.152: v22.81,48.84 25.25,48.84 26.47,50.06 27.08,50.06 27.38,49.76 27.38,46.71 23.42,42.75 23.42,42.14 23.72,41.83 24.33,41.83 27.53,45.03 27.53,45.34 28.3,46.1 31.95,46.1 34.24,43.81 34.24,14.55 v32.11,12.42
  Bottom 0.152: v22.81,48.84 22.35,49.3 22.35,52.05 FL_UPPER.38 | IC1.23 v32.11,12.42
D13  (via drill 0.35)
  Top 0.152: v33.63,19.13 v33.63,34.37
  Bottom 0.152: v33.63,34.37 33.63,51.13 30.43,54.33 24.18,54.33 22.81,52.96 22.81,52.2 FL_UPPER.39 | v33.63,19.13 29.21,14.71 IC1.25
D14  (via drill 0.35)
  Top 0.152: v25.86,40.31 26.31,39.85 26.31,38.94 26.01,38.63 23.57,38.63 23.42,38.48 23.42,34.98 v27.53,30.86
  Bottom 0.152: v25.86,40.31 25.86,45.49 23.42,47.93 23.42,52.05 FL_UPPER.40 | v27.53,30.86 30.12,30.86 30.89,30.1 30.89,28.12 32.71,26.29 32.71,20.8 31.65,19.74 29.21,19.74 IC1.27
D15  (via drill 0.35)
  Top 0.152: v31.5,26.14 v31.5,38.63
  Bottom 0.152: v31.5,38.63 31.5,42.29 30.28,43.51 28.75,43.51 23.88,48.39 23.88,52.05 FL_UPPER.41 | v31.5,26.14 30.58,26.14 IC1.29
DATABUSP0
  Top 0.152: FLASHBOARD.14 68.53,19.74 68.53,22.17 FLASHBOARD.13 68.53,22.33 64.26,26.59 63.5,26.59 PROGRAMMER.13
DATABUSP1
  Top 0.152: 68.53,17.14 68.53,14.71 FLASHBOARD.16 | PROGRAMMER.14 63.5,23.55 67,20.04 67,18.67 68.53,17.14 | 68.53,17.14 FLASHBOARD.15
DATABUSP2
  Top 0.152: FLASHBOARD.18 68.53,9.52 68.53,11.96 FLASHBOARD.17 67,13.64 67,17.6 63.5,21.11 PROGRAMMER.15
DATABUSP3
  Top 0.152: FLASHBOARD.20 68.53,4.5 68.53,6.93 FLASHBOARD.19 78.74,17.14 PROGRAMMER.17
DATABUSP4
  Top 0.152: FLASHBOARD.22 83.77,7.09 83.77,9.52 FLASHBOARD.23
  Bottom 0.152: PROGRAMMER.18 78.74,21.11 82.25,17.6 82.25,11.05 83.77,9.52 FLASHBOARD.23
DATABUSP5
  Top 0.152: FLASHBOARD.24 83.77,12.12 83.77,14.55 FLASHBOARD.25 83.77,14.71 82.25,16.23 82.25,20.04 78.74,23.55 PROGRAMMER.19
DATABUSP6
  Top 0.152: FLASHBOARD.26 83.77,17.14 83.77,19.58 FLASHBOARD.27 82.25,21.26 82.25,22.63 78.74,26.14 PROGRAMMER.20
DATABUSP7
  Top 0.152: 83.77,24.77 79.35,29.19 78.74,29.19 PROGRAMMER.21 | 83.77,24.77 83.77,22.33 FLASHBOARD.28 | 83.77,24.77 FLASHBOARD.29
GND  (via drill 0.35)
  Top 0.152: 18.54,35.28 18.85,34.98 19,34.98 19.3,34.67 19.3,34.06 18.54,33.3 12.9,33.3 11.23,31.62 11.23,29.34 13.21,27.36 13.97,27.36 IC1.11 | 18.54,35.28 18.39,35.43 U1.4 18.54,35.28 | GOSWITCH.1 22.81,51.44 v21.44,50.06 | C1.2 20.52,42.6 20.52,45.19 20.07,45.64 C2.- 19.91,45.8 19.91,48.54 19.3,49.15 18.09,49.15 16.71,50.52 16.71,53.87 18.24,55.4 19.15,55.4 | 19.15,55.4 20.07,54.48 20.52,54.48 R7.1 | 19.15,55.4 v19.15,55.7 | v17.02,12.57 17.02,9.37 22.96,3.43 30.12,3.43 30.89,4.19 v30.89,5.71 | v20.52,37.26 18.54,35.28
  Bottom 0.152: 21.29,22.94 20.98,22.94 FL_LOWER.35 20.98,22.78 20.98,19.28 21.13,19.13 21.13,16.69 v17.02,12.57 | IC1.30 29.21,27.2 28.75,26.75 25.09,26.75 C4.2 24.94,26.59 23.27,24.92 21.59,24.92 21.29,24.61 21.29,22.94 | 21.29,22.94 FL_LOWER.36 | 21.44,55.86 21.44,52.2 FL_UPPER.36 | 21.44,55.86 21.44,56.01 22.35,56.92 24.03,56.92 24.94,56.01 C3.2 25.09,55.86 29.36,55.86 34.7,50.52 34.7,9.98 30.89,6.17 v30.89,5.71 | FL_UPPER.35 20.98,52.2 21.29,52.2 FL_UPPER.36 | FL_UPPER.36 21.44,52.05 v21.44,50.06 20.83,49.45 20.83,38.02 20.52,37.72 v20.52,37.26 | 21.44,55.86 19.15,55.86 | 19.15,55.86 17.78,55.86 | 17.78,55.86 17.32,55.86 BUZZ.1 | v19.15,55.7 19.15,55.86 | BUZZER.2 3.67,55.74 4.45,56.52 12.7,56.52 13.97,57.78 17.78,57.78 17.78,55.86
  pour Top: 0,59.05 36.2,59.05 36.2,0 0,0
  pour Bottom: 0,59.05 36.2,59.05 36.2,0 0,0
GNDP
  Top 0.152: FLASHBOARD.30 83.77,27.36 82.55,27.36 79.81,30.1 77.67,30.1 74.93,27.36 68.68,27.36 FLASHBOARD.11
  Bottom 0.152: PROGRAMMER.16 63.5,19.58 67,23.09 67,25.68 68.53,27.2 FLASHBOARD.11
  pour Top: 57.15,59.05 89.53,59.05 89.53,0 57.15,0
  pour Bottom: 57.15,59.05 89.53,59.05 89.53,0 57.15,0
N$1
  Top 0.152: LED1.C 22.66,56.77 22.66,54.48 R7.2
N$2
  Bottom 0.152: SV1.1 4.98,5.11 4.98,7.24 2.69,9.52 2.69,42.75 4.98,45.03 PGM_WR_HL.2
N$3
  Top 0.152: A500REV5.2 19.91,29.79 20.37,29.79 22.66,27.51 25.7,27.51 27.99,29.79 29.21,29.79 IC1.31
N$6  (via drill 0.35)
  Top 0.152: SJ1.2 19.15,51.44 19.15,51.13 20.83,49.45 24.49,49.45 26.16,51.13 GOSWITCH.2 v26.16,53.72 | v26.31,21.26 26.31,21.87 25.09,23.09 25.09,25.53 R2.2 | v31.5,20.5 31.5,21.56 32.71,22.78 v32.71,33.45 | v27.08,36.5 25.55,38.02 24.94,38.02 U1.7
  Bottom 0.152: v26.31,21.26 26.77,21.26 27.38,20.65 31.34,20.65 v31.5,20.5 | 29.97,36.2 29.67,36.5 v27.08,36.5 | 29.97,36.2 v32.71,33.45 | v26.16,53.72 26.62,53.72 26.92,54.03 30.28,54.03 33.02,51.28 33.02,39.24 29.97,36.2
N$7  (via drill 0.35)
  Top 0.152: v6.81,30.71 v8.03,29.49 | v6.81,43.36 7.72,43.36 9.4,45.03 PGM_OE_HL.2
  Bottom 0.152: IC1.12 9.86,24.77 9.55,24.46 8.94,24.46 8.03,25.38 v8.03,29.49 | v6.81,30.71 6.81,31.47 7.11,31.77 7.11,43.05 v6.81,43.36
N$8
  Top 0.152: SJ1.3 20.52,51.44 20.52,51.74 18.09,54.18 18.09,54.79 18.39,55.09 19,55.09 19.76,54.33 19.76,53.42 19.91,53.26 23.27,53.26 26.62,56.62 27.23,56.62 SENSE.1
N$9
  Top 0.152: R1.1 23.11,29.95 23.11,34.37 21.44,36.04 21.44,37.72 19.91,39.24 18.39,39.24 U1.1
N$10
  Bottom 0.152: SV2.1 59.69,50.22 62.43,52.96 63.8,52.96 65.33,54.48 78.74,54.48 PROGRAMMER.31
N$15
  Top 0.152: U1.3 18.24,36.96 17.63,36.96 15.65,38.94 15.65,40.31 15.04,40.92 11.68,40.92 9.55,38.79 PGM_A18.2
OEN_LOWER  (via drill 0.35)
  Top 0.152: PGM_EN.1 5.13,38.79 5.59,38.79 9.4,42.6 PGM_OE_HL.1 | v24.49,18.82 24.18,18.52 24.18,16.08 23.27,15.16 23.27,12.57 R5.1 23.11,12.57 22.5,11.96 v21.44,11.96 | v3.3,36.96 3.3,18.82 v8.64,13.49 | v12.29,8.76 12.29,9.83 13.51,11.05 14.88,11.05 v16.1,12.27
  Bottom 0.152: v24.49,18.82 23.88,19.43 23.88,21.11 24.79,22.02 24.79,22.78 FL_LOWER.43 | v3.3,36.96 PGM_EN.1 | v8.64,13.49 8.64,12.42 v12.29,8.76 | v16.1,12.27 16.41,12.27 16.71,11.96 v21.44,11.96
OEN_UPPER  (via drill 0.35)
  Top 0.152: v29.82,48.84 30.89,49.91 30.89,55.55 28.75,57.68 15.49,57.68 12.14,54.33 v12.14,53.26 | v18.85,20.04 21.13,20.04 22.2,21.11 23.11,21.11 R3.1 | v7.72,16.23 3.76,20.19 3.76,34.98 4.98,36.2 | 4.98,36.2 3.3,37.87 3.3,42.9 3.91,43.51 5.59,43.51 9.4,47.32 9.4,47.62 PGM_OE_HL.3 | 4.98,36.2 PGM_EN.2
  Bottom 0.152: v29.82,48.84 26.47,48.84 24.94,50.37 24.94,52.05 FL_UPPER.43 | v12.14,53.26 12.14,50.22 9.55,47.62 PGM_OE_HL.3 | v18.85,20.04 15.04,16.23 v7.72,16.23
OENP
  Bottom 0.152: FLASHBOARD.12 68.68,24.77 68.68,25.38 77.06,33.76 77.06,35.13 78.74,36.8 PROGRAMMER.24
ROM_ENABLE  (via drill 0.35)
  Top 0.152: v18.54,9.68 18.54,10.59 17.93,11.2 17.93,13.03 v16.26,14.71 | v12.6,15.62 12.6,16.53 11.99,17.14 11.99,26.44 v11.38,27.05 | v22.2,31.47 18.09,31.47 16.56,29.95 13.97,29.95 IC1.10
  Bottom 0.152: v18.54,9.68 22.35,5.87 22.35,3.89 FL_LOWER.11 | v16.26,14.71 15.8,14.71 14.88,15.62 v12.6,15.62 | v11.38,27.05 13.97,29.64 IC1.10 | v22.2,31.47 22.35,31.62 22.35,32.84 FL_UPPER.11
VCC  (via drill 0.35)
  Top 0.152: 25.09,6.48 25.09,8.15 R6.2 | 25.09,6.48 27.08,4.5 29.21,4.5 IC1.21 | 22.5,24.92 23.11,25.53 R2.1 | 22.5,24.92 v21.89,24.31 24.94,21.26 R3.2 25.09,21.11 25.09,16.99 R4.2 25.09,16.84 25.09,12.57 | 25.09,6.48 24.79,6.48 23.57,5.26 22.96,5.26 21.89,6.32 21.89,9.37 25.09,12.57 | 25.09,12.57 R5.2 | 23.72,39.24 23.11,38.63 23.11,34.82 25.09,32.84 25.09,29.95 R1.2 | 23.72,39.24 24.79,39.24 U1.8 | 23.72,39.24 22.66,40.31 22.66,42.44 C1.1 22.66,42.6 22.66,45.19 23.11,45.64 C2.+ 23.27,45.8 v24.64,45.8 | v21.89,25.53 22.5,24.92
  Bottom 0.152: FL_LOWER.14 20.83,3.89 20.83,4.65 20.98,4.8 21.59,4.8 21.74,4.65 21.74,3.89 FL_LOWER.12 21.89,3.73 21.89,2.82 22.66,2.06 28.3,2.06 29.21,2.97 IC1.21 | v21.89,24.31 21.89,22.94 FL_LOWER.37 | C3.1 23.11,55.86 23.11,54.33 21.89,53.11 21.89,52.2 FL_UPPER.37 21.89,52.05 21.89,50.52 22.05,50.37 22.05,48.39 v24.64,45.8 25.25,45.19 25.25,38.48 21.89,35.13 21.89,32.99 FL_UPPER.12 21.74,32.84 21.74,31.93 21.59,31.77 20.68,31.77 | 21.44,25.98 20.98,25.98 20.68,26.29 20.68,31.77 | 21.44,25.98 21.59,25.98 22.2,26.59 23.11,26.59 C4.1 | 20.68,31.77 20.68,31.93 20.83,32.08 20.83,32.84 FL_UPPER.14 | 21.44,25.98 v21.89,25.53
VCCP
  Top 0.152: PROGRAMMER.32 78.74,57.07 81.48,57.07 85.45,53.11 85.45,6.02 83.92,4.5 FLASHBOARD.21
WEN_LOWER  (via drill 0.35)
  Top 0.152: v24.49,19.74 23.27,18.52 23.27,16.99 R4.1 | v12.29,44.12 8.94,44.12 7.42,42.6 5.13,42.6 PGM_WR_HL.1 | v17.32,44.27 19.76,41.83 19.76,41.68 19.91,41.53 21.44,41.53 21.59,41.68 21.59,46.86 22.05,47.32 v26.16,47.32 | v32.41,43.81 32.41,34.67 33.33,33.76 33.33,28.12 33.02,27.81 33.02,20.04 v32.11,19.13
  Bottom 0.152: FL_LOWER.44 25.25,22.78 25.25,22.02 24.49,21.26 v24.49,19.74 25.55,18.67 30.12,18.67 30.58,19.13 v32.11,19.13 | v12.29,44.12 17.17,44.12 v17.32,44.27 | v26.16,47.32 27.53,47.32 28.75,46.1 30.12,46.1 v32.41,43.81
WEN_UPPER  (via drill 0.35)
  Top 0.152: v22.81,6.78 23.11,7.09 23.11,8.15 R6.1 | v6.81,14.4 6.81,14.86 2.69,18.97 2.69,45.34 4.98,47.62 PGM_WR_HL.3 | v24.79,53.57 24.03,53.57 23.42,52.96 19.76,52.96 18.69,54.03 v18.69,54.48
  Bottom 0.152: v22.81,6.78 22.81,8.15 19.3,11.66 15.49,11.66 14.88,11.05 13.06,11.05 9.7,14.4 v6.81,14.4 | v24.79,53.57 25.25,53.11 25.25,52.2 FL_UPPER.44 | v18.69,54.48 11.53,54.48 5.13,48.08 5.13,47.62 PGM_WR_HL.3

### Text on the board
tPlace: YAKS2-TITUO rev3.1a / by EmberHeavyIndustries 2019 / https://github.com/EmberHeavyIndustries/HID2AMI